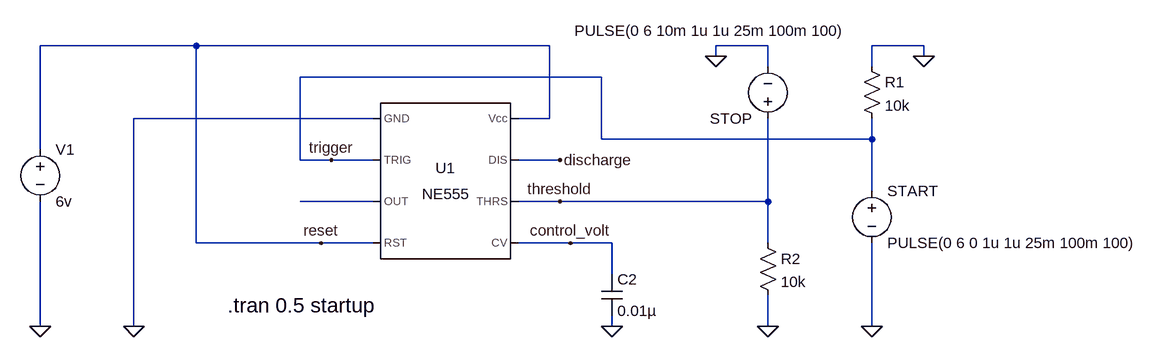
[diagram p0: schematic timer555_bistable.asc]
timer555_bistable.asc, the LTspice schematic file:
Version 4
SHEET 1 1108 680
WIRE -368 -80 -608 -80
WIRE 176 -80 -368 -80
WIRE 512 -80 432 -80
WIRE 752 -80 672 -80
WIRE 432 -64 432 -80
WIRE 752 -64 752 -80
WIRE 512 -48 512 -80
WIRE 672 -48 672 -80
WIRE 256 -32 -208 -32
WIRE -96 32 -464 32
WIRE 176 32 176 -80
WIRE 176 32 128 32
WIRE 256 64 256 -32
WIRE 672 64 672 32
WIRE 672 64 256 64
WIRE -608 80 -608 -80
WIRE -208 96 -208 -32
WIRE -160 96 -208 96
WIRE -96 96 -160 96
WIRE 192 96 128 96
WIRE 672 144 672 64
WIRE -96 160 -208 160
WIRE 192 160 128 160
WIRE 512 160 512 32
WIRE 512 160 192 160
WIRE -368 224 -368 -80
WIRE -176 224 -368 224
WIRE -96 224 -176 224
WIRE 208 224 128 224
WIRE 272 224 208 224
WIRE 512 224 512 160
WIRE 272 272 272 224
WIRE -608 352 -608 160
WIRE -464 352 -464 32
WIRE 272 352 272 336
WIRE 512 352 512 304
WIRE 672 352 672 224
FLAG -464 352 0
FLAG -608 352 0
FLAG -160 96 trigger
FLAG -176 224 reset
FLAG 272 352 0
FLAG 192 96 discharge
FLAG 192 160 threshold
FLAG 208 224 control_volt
FLAG 672 352 0
FLAG 512 352 0
FLAG 432 -64 0
FLAG 752 -64 0
SYMBOL Misc\\NE555 16 128 R0
SYMATTR InstName U1
SYMBOL voltage -608 64 R0
WINDOW 123 0 0 Left 0
WINDOW 39 0 0 Left 0
SYMATTR InstName V1
SYMATTR Value 6v
SYMBOL res 656 -64 R0
SYMATTR InstName R1
SYMATTR Value 10k
SYMBOL cap 256 272 R0
SYMATTR InstName C2
SYMATTR Value 0.01µ
SYMBOL voltage 672 128 R0
WINDOW 123 0 0 Left 0
WINDOW 39 0 0 Left 0
SYMATTR InstName START
SYMATTR Value PULSE(0 6 0 1u 1u 25m 100m 100)
SYMBOL voltage 512 48 R180
WINDOW 123 0 0 Left 0
WINDOW 39 0 0 Left 0
WINDOW 3 -121 151 Left 2
SYMATTR Value PULSE(0 6 10m 1u 1u 25m 100m 100)
SYMATTR InstName STOP
SYMBOL res 496 208 R0
SYMATTR InstName R2
SYMATTR Value 10k
TEXT -320 320 Left 3 !.tran 0.5 startup

The netlist it stands for:
* timer555_bistable.asc
XU1 0 trigger N001 reset control_volt threshold discharge reset NE555  ; pins GND TRIG OUT RST CV THRS DIS Vcc
V1 reset 0 6v
R1 0 trigger 10k
C2 control_volt 0 0.01µ
V§START trigger 0 PULSE(0 6 0 1u 1u 25m 100m 100)
V§STOP threshold 0 PULSE(0 6 10m 1u 1u 25m 100m 100)
R2 threshold 0 10k
.tran 0.5 startup
.lib NE555.sub
.backanno
.end